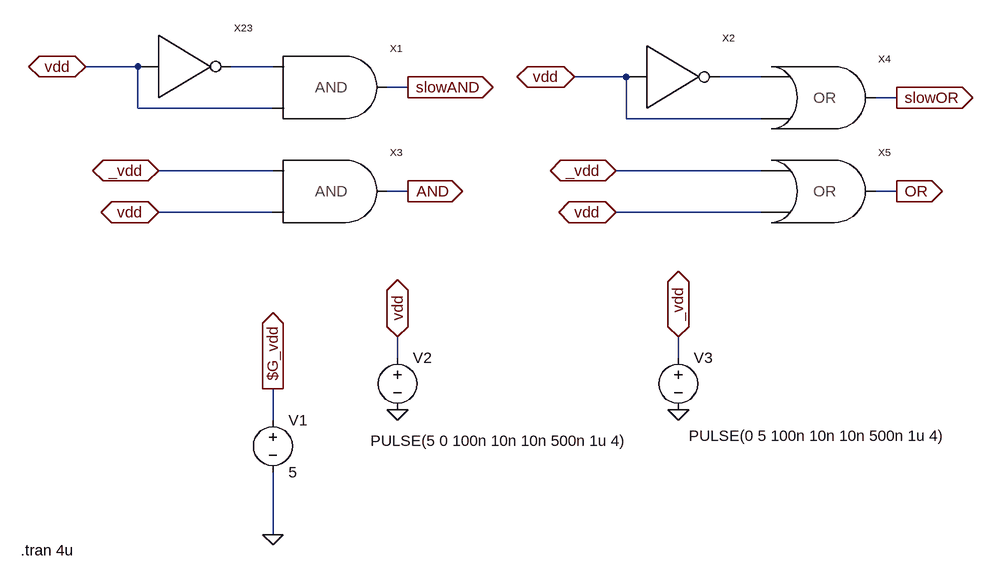
[diagram p0: schematic test_noise_OR_AND.asc]
test_noise_OR_AND.asc, the LTspice schematic file:
Version 4
SHEET 1 2184 680
WIRE 736 -208 656 -208
WIRE 944 -208 880 -208
WIRE 1488 -192 1408 -192
WIRE 1696 -192 1632 -192
WIRE 1152 -176 1120 -176
WIRE 1904 -160 1872 -160
WIRE 736 -144 736 -208
WIRE 944 -144 736 -144
WIRE 1488 -128 1488 -192
WIRE 1696 -128 1488 -128
WIRE 944 -48 768 -48
WIRE 1696 -48 1472 -48
WIRE 1152 -16 1120 -16
WIRE 1904 -16 1872 -16
WIRE 944 16 768 16
WIRE 1696 16 1472 16
WIRE 1136 240 1136 208
WIRE 1568 240 1568 208
WIRE 944 336 944 288
WIRE 944 512 944 416
FLAG 1152 -176 slowAND
IOPIN 1152 -176 Out
FLAG 944 512 0
FLAG 944 288 $G_vdd
IOPIN 944 288 Out
FLAG 1568 320 0
FLAG 1152 -16 AND
IOPIN 1152 -16 Out
FLAG 1136 320 0
FLAG 1904 -160 slowOR
IOPIN 1904 -160 Out
FLAG 1904 -16 OR
IOPIN 1904 -16 Out
FLAG 1136 208 vdd
IOPIN 1136 208 BiDir
FLAG 768 16 vdd
IOPIN 768 16 BiDir
FLAG 1472 16 vdd
IOPIN 1472 16 BiDir
FLAG 1408 -192 vdd
IOPIN 1408 -192 BiDir
FLAG 656 -208 vdd
IOPIN 656 -208 BiDir
FLAG 1568 208 _vdd
IOPIN 1568 208 BiDir
FLAG 1472 -48 _vdd
IOPIN 1472 -48 BiDir
FLAG 768 -48 _vdd
IOPIN 768 -48 BiDir
SYMBOL inverter 768 -208 R0
SYMATTR InstName X23
SYMBOL AND_2 960 -176 R0
SYMATTR InstName X1
SYMBOL voltage 944 320 R0
SYMATTR InstName V1
SYMATTR Value 5
SYMBOL voltage 1136 224 R0
WINDOW 123 0 0 Left 0
WINDOW 39 0 0 Left 0
WINDOW 3 -42 144 Left 2
SYMATTR Value PULSE(5 0 100n 10n 10n 500n 1u 4)
SYMATTR InstName V2
SYMBOL AND_2 960 -16 R0
SYMATTR InstName X3
SYMBOL voltage 1568 224 R0
WINDOW 123 0 0 Left 0
WINDOW 39 0 0 Left 0
WINDOW 3 16 136 Left 2
SYMATTR Value PULSE(0 5 100n 10n 10n 500n 1u 4)
SYMATTR InstName V3
SYMBOL inverter 1520 -192 R0
SYMATTR InstName X2
SYMBOL OR_2 1712 -160 R0
SYMATTR InstName X4
SYMBOL OR_2 1712 -16 R0
SYMATTR InstName X5
TEXT 556 536 Left 2 !.tran 4u

The netlist it stands for:
* test_noise_OR_AND.asc
XX23 vdd N001 inverter  ; pins Vin Vout
XX1 N001 vdd slowAND AND_2  ; pins Vin1 Vin2 Vout
V1 $G_vdd 0 5
V2 vdd 0 PULSE(5 0 100n 10n 10n 500n 1u 4)
XX3 _vdd vdd AND AND_2  ; pins Vin1 Vin2 Vout
V3 _vdd 0 PULSE(0 5 100n 10n 10n 500n 1u 4)
XX2 vdd N002 inverter  ; pins Vin Vout
XX4 N002 vdd slowOR OR_2  ; pins Vin1 Vin2 Vout
XX5 _vdd vdd OR OR_2  ; pins Vin1 Vin2 Vout
.tran 4u
.backanno
.end